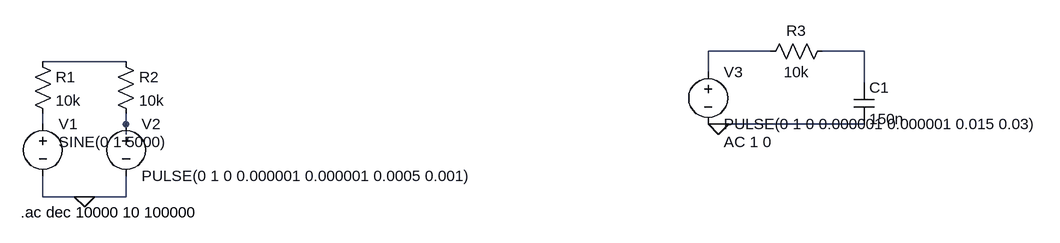
[diagram p0: schematic Lab1.asc]
Lab1.asc, the LTspice schematic file:
Version 4
SHEET 1 1612 680
WIRE 1136 32 1040 32
WIRE 1280 32 1216 32
WIRE 144 48 16 48
WIRE 1040 64 1040 32
WIRE 1280 80 1280 32
WIRE 16 144 16 128
WIRE 144 144 144 128
WIRE 1056 144 1040 144
WIRE 1280 144 1056 144
WIRE 144 160 144 144
WIRE 16 256 16 224
WIRE 80 256 16 256
WIRE 144 256 144 224
WIRE 144 256 80 256
FLAG 80 256 0
FLAG 1056 144 0
SYMBOL voltage 16 128 R0
WINDOW 3 24 44 Left 2
WINDOW 123 0 0 Left 0
WINDOW 39 0 0 Left 0
SYMATTR InstName V1
SYMATTR Value SINE(0 1 5000)
SYMBOL voltage 144 128 R0
WINDOW 123 0 0 Left 0
WINDOW 39 0 0 Left 0
SYMATTR InstName V2
SYMATTR Value PULSE(0 1 0 0.000001 0.000001 0.0005 0.001)
SYMBOL res 0 32 R0
SYMATTR InstName R1
SYMATTR Value 10k
SYMBOL res 128 32 R0
SYMATTR InstName R2
SYMATTR Value 10k
SYMBOL voltage 1040 48 R0
WINDOW 123 24 124 Left 2
WINDOW 39 0 0 Left 0
SYMATTR InstName V3
SYMATTR Value PULSE(0 1 0 0.000001 0.000001 0.015 0.03)
SYMATTR Value2 AC 1 0
SYMBOL res 1232 16 R90
WINDOW 0 0 56 VBottom 2
WINDOW 3 32 56 VTop 2
SYMATTR InstName R3
SYMATTR Value 10k
SYMBOL cap 1264 80 R0
SYMATTR InstName C1
SYMATTR Value 150n
TEXT -18 280 Left 2 !.ac dec 10000 10 100000

The netlist it stands for:
* Lab1.asc
V1 N004 0 SINE(0 1 5000)
V2 N005 0 PULSE(0 1 0 0.000001 0.000001 0.0005 0.001)
R1 N003 N004 10k
R2 N003 N005 10k
V3 N001 0 PULSE(0 1 0 0.000001 0.000001 0.015 0.03) AC 1 0
R3 N002 N001 10k
C1 N002 0 150n
.ac dec 10000 10 100000
.backanno
.end